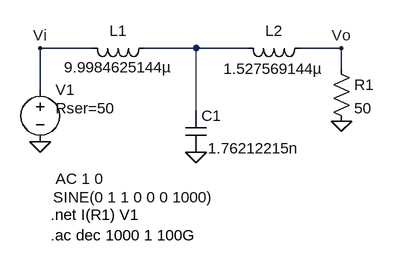
[diagram p0: schematic Circuito_Desnormalizado.asc]
Circuito_Desnormalizado.asc, the LTspice schematic file:
Version 4
SHEET 1 880 680
WIRE 112 96 32 96
WIRE 272 96 192 96
WIRE 352 96 272 96
WIRE 496 96 432 96
WIRE 496 128 496 96
WIRE 32 160 32 96
WIRE 272 192 272 96
FLAG 32 240 0
FLAG 496 208 0
FLAG 272 256 0
FLAG 32 96 Vi
FLAG 496 96 Vo
SYMBOL ind 96 80 M90
WINDOW 0 5 56 VBottom 2
WINDOW 3 30 57 VTop 2
SYMATTR InstName L1
SYMATTR Value 9.9984625144µ
SYMBOL ind 448 80 R90
WINDOW 0 5 56 VBottom 2
WINDOW 3 32 56 VTop 2
SYMATTR InstName L2
SYMATTR Value 1.527569144µ
SYMBOL res 480 112 R0
SYMATTR InstName R1
SYMATTR Value 50
SYMBOL cap 256 192 R0
WINDOW 3 34 58 Left 2
SYMATTR InstName C1
SYMATTR Value 1.76212215n
SYMBOL voltage 32 144 R0
WINDOW 3 20 181 Left 2
WINDOW 123 24 153 Left 2
WINDOW 39 24 44 Left 2
SYMATTR Value SINE(0 1 1 0 0 0 1000)
SYMATTR Value2 AC 1 0
SYMATTR SpiceLine Rser=50
SYMATTR InstName V1
TEXT 48 352 Left 2 !.net I(R1) V1
TEXT 48 384 Left 2 !.ac dec 1000 1 100G

The netlist it stands for:
* Circuito_Desnormalizado.asc
L1 Vi N001 9.9984625144µ
L2 Vo N001 1.527569144µ
R1 Vo 0 50
C1 N001 0 1.76212215n
V1 Vi 0 SINE(0 1 1 0 0 0 1000) AC 1 0 Rser=50
.net I(R1) V1
.ac dec 1000 1 100G
.backanno
.end